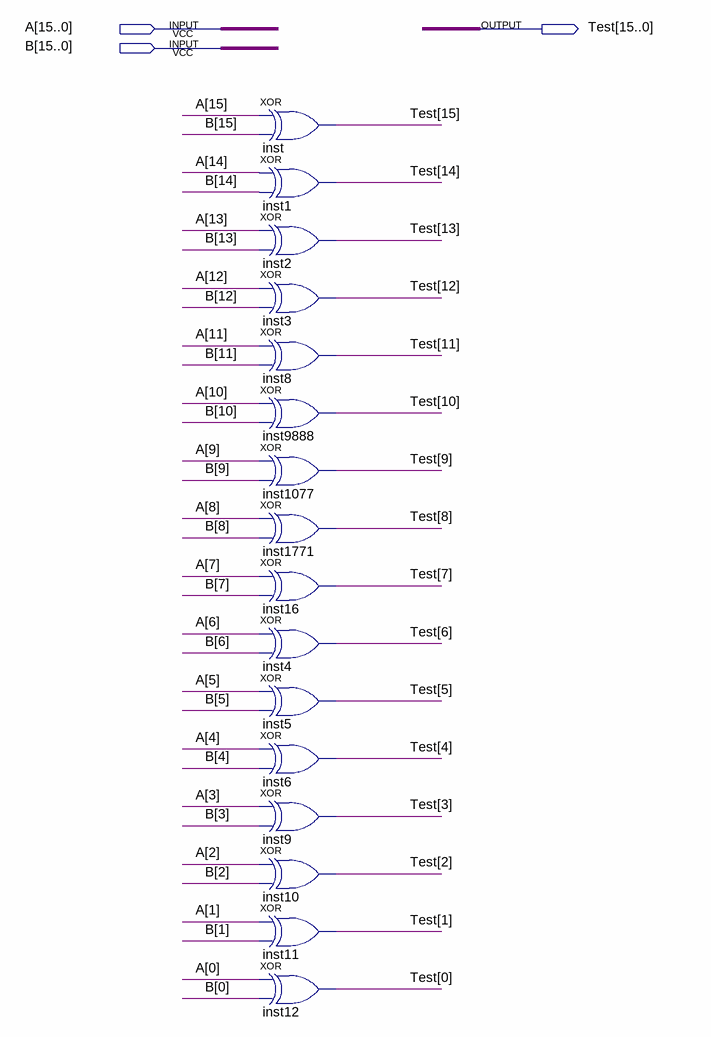
[diagram p0: schematic sheet]
// Quartus schematic Mult_tester.bdf as structural Verilog: 16 symbols, 3 pins
module Mult_tester (
  input  [15:0] A,
  input  [15:0] B,
  output [15:0] Test
);

  xor inst (Test[15], A[15], B[15]);
  xor inst1 (Test[14], A[14], B[14]);
  xor inst2 (Test[13], A[13], B[13]);
  xor inst3 (Test[12], A[12], B[12]);
  xor inst8 (Test[11], A[11], B[11]);
  xor inst9888 (Test[10], A[10], B[10]);
  xor inst1077 (Test[9], A[9], B[9]);
  xor inst1771 (Test[8], A[8], B[8]);
  xor inst16 (Test[7], A[7], B[7]);
  xor inst4 (Test[6], A[6], B[6]);
  xor inst5 (Test[5], A[5], B[5]);
  xor inst6 (Test[4], A[4], B[4]);
  xor inst9 (Test[3], A[3], B[3]);
  xor inst10 (Test[2], A[2], B[2]);
  xor inst11 (Test[1], A[1], B[1]);
  xor inst12 (Test[0], A[0], B[0]);
endmodule
